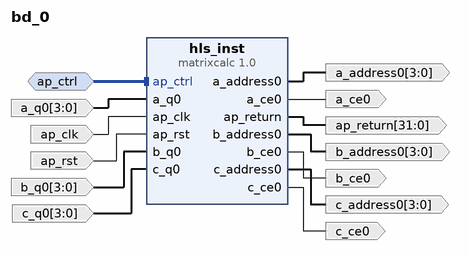
[diagram p0: block diagram of the top level]
# Vivado block design bd_0, xc7z020clg400-1, Vivado 2023.1
create_bd_design bd_0

create_bd_intf_port -mode Slave -vlnv xilinx.com:interface:acc_handshake_rtl:1.0 ap_ctrl
create_bd_port -dir O -from 3 -to 0 -type data a_address0
create_bd_port -dir O a_ce0
create_bd_port -dir I -from 3 -to 0 -type data a_q0
create_bd_port -dir I -type clk ap_clk
set_property -dict {CONFIG.FREQ_HZ 125000000.0} [get_bd_ports ap_clk]
create_bd_port -dir O -from 31 -to 0 -type data ap_return
create_bd_port -dir I -type rst ap_rst
set_property -dict {CONFIG.POLARITY ACTIVE_HIGH} [get_bd_ports ap_rst]
create_bd_port -dir O -from 3 -to 0 -type data b_address0
create_bd_port -dir O b_ce0
create_bd_port -dir I -from 3 -to 0 -type data b_q0
create_bd_port -dir O -from 3 -to 0 -type data c_address0
create_bd_port -dir O c_ce0
create_bd_port -dir I -from 3 -to 0 -type data c_q0

create_bd_cell -type ip -vlnv xilinx.com:hls:matrixcalc:1.0 hls_inst

# ---- connections ----

connect_bd_intf_net -intf_net ap_ctrl_0_1 [get_bd_intf_ports ap_ctrl] [get_bd_intf_pins hls_inst/ap_ctrl]
connect_bd_net -net a_q0_0_1 [get_bd_ports a_q0] [get_bd_pins hls_inst/a_q0]
connect_bd_net -net ap_clk_0_1 [get_bd_ports ap_clk] [get_bd_pins hls_inst/ap_clk]
connect_bd_net -net ap_rst_0_1 [get_bd_ports ap_rst] [get_bd_pins hls_inst/ap_rst]
connect_bd_net -net b_q0_0_1 [get_bd_ports b_q0] [get_bd_pins hls_inst/b_q0]
connect_bd_net -net c_q0_0_1 [get_bd_ports c_q0] [get_bd_pins hls_inst/c_q0]
connect_bd_net [get_bd_pins hls_inst/a_address0] [get_bd_ports a_address0]
connect_bd_net [get_bd_pins hls_inst/a_ce0] [get_bd_ports a_ce0]
connect_bd_net [get_bd_pins hls_inst/ap_return] [get_bd_ports ap_return]
connect_bd_net [get_bd_pins hls_inst/b_address0] [get_bd_ports b_address0]
connect_bd_net [get_bd_pins hls_inst/b_ce0] [get_bd_ports b_ce0]
connect_bd_net [get_bd_pins hls_inst/c_address0] [get_bd_ports c_address0]
connect_bd_net [get_bd_pins hls_inst/c_ce0] [get_bd_ports c_ce0]

validate_bd_design
save_bd_design
